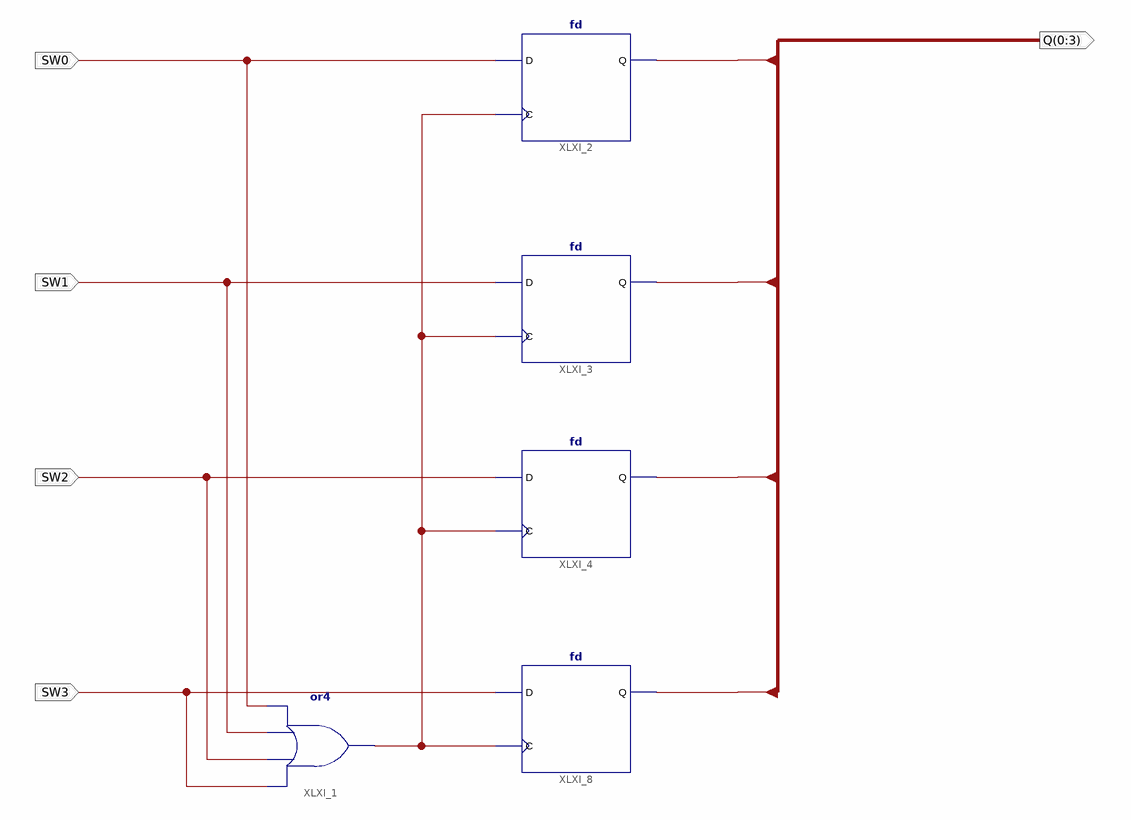
[diagram p0: schematic sheet 1]
// Xilinx ISE schematic SELECTOR.sch (spartan6) as structural Verilog: 5 symbols, 5 ports
module SELECTOR (
  input  SW0,
  input  SW1,
  input  SW2,
  input  SW3,
  output [0:3] Q
);

  wire XLXN_7;

  or XLXI_1 (XLXN_7, SW3, SW2, SW1, SW0);
  fd XLXI_2 (.C(XLXN_7), .D(SW0), .Q(Q[0]));
  fd XLXI_3 (.C(XLXN_7), .D(SW1), .Q(Q[1]));
  fd XLXI_4 (.C(XLXN_7), .D(SW2), .Q(Q[2]));
  fd XLXI_8 (.C(XLXN_7), .D(SW3), .Q(Q[3]));
endmodule
